# EAGLE schematic Печатная плата управляющая (EAGLE 9.0.0)
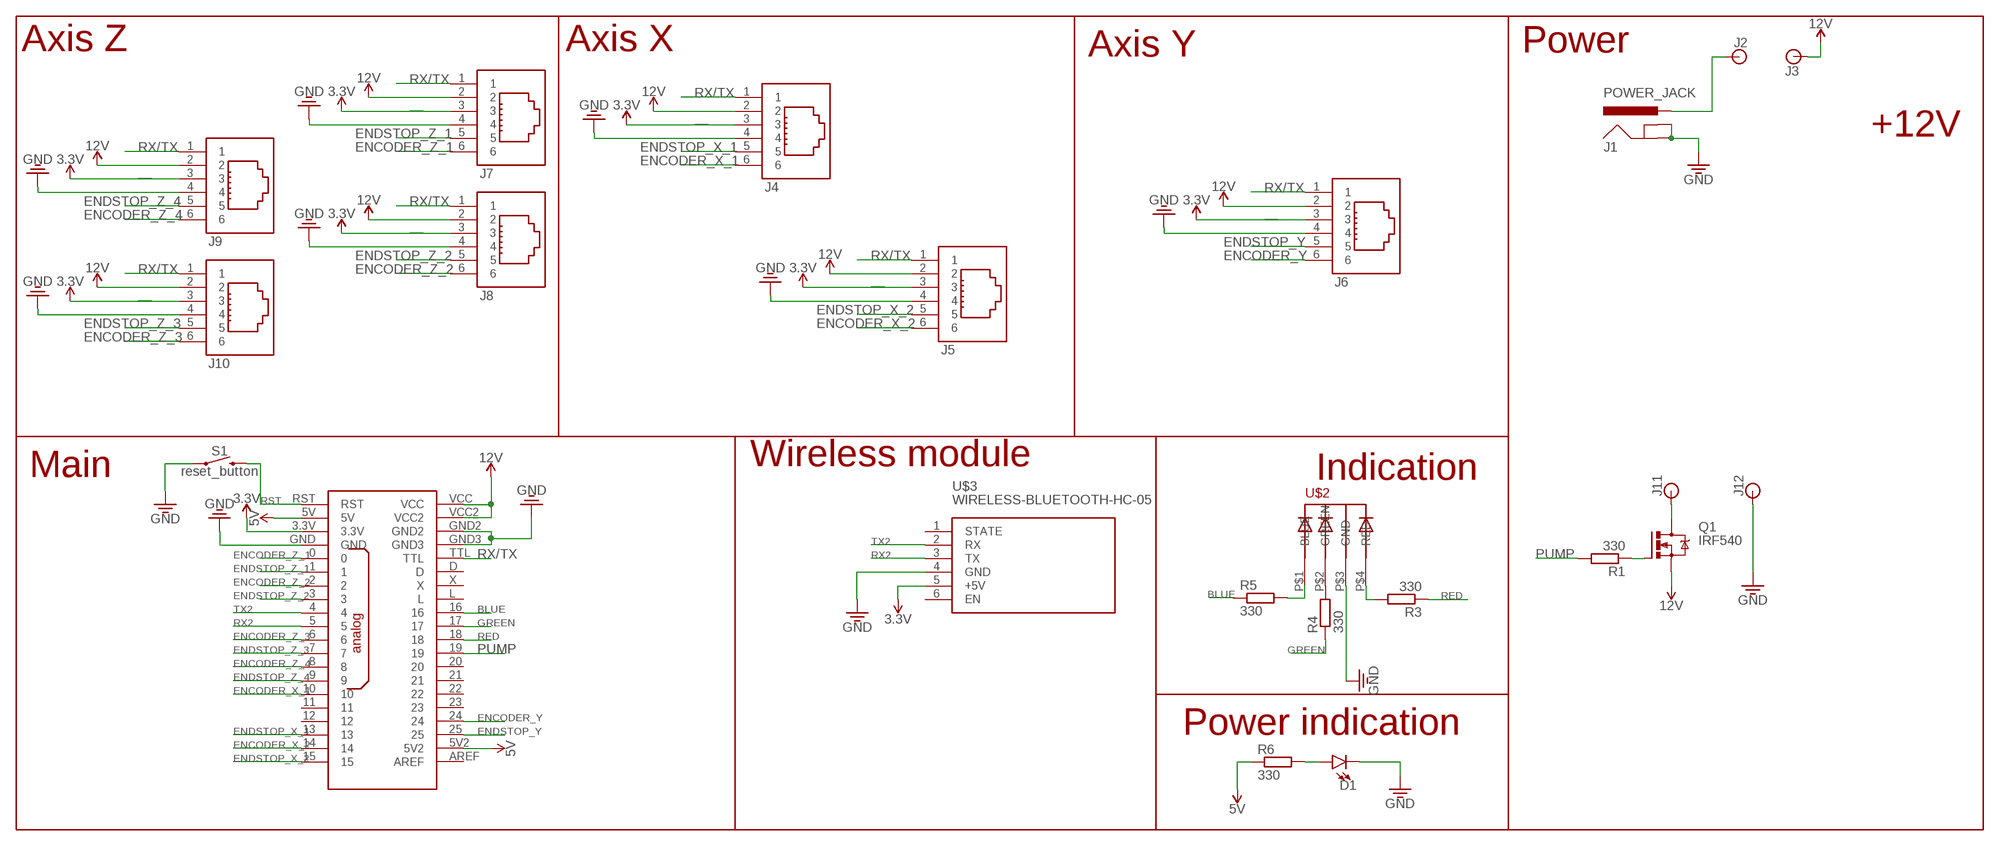
[diagram p0: schematic, sheet 1]

## Parts
D1  LED5MM  [LED_5MM]
J1  POWER_JACK  [POWER_JACK_PTH]
J2  BANANA_CONN  [BANANA_CONN]
J3  BANANA_CONN  [BANANA_CONN]
J4  615006138421  [615006138421]
J5  615006138421  [615006138421]
J6  615006138421  [615006138421]
J7  615006138421  [615006138421]
J8  615006138421  [615006138421]
J9  615006138421  [615006138421]
J10  615006138421  [615006138421]
J11  BANANA_CONN  [BANANA_CONN]
J12  BANANA_CONN  [BANANA_CONN]
Q1  IRF540  [TO220BV]
R1  330  R-EU_0204/7  [0204/7]
R3  330  R-EU_0204/7  [0204/7]
R4  330  R-EU_0204/7  [0204/7]
R5  330  R-EU_0204/7  [0204/7]
R6  330  R-EU_0204/7  [0204/7]
S1  reset_button  MOMENTARY-SWITCH-SPST-PTH-6.0MM  [TACTILE_SWITCH_PTH_6.0MM]
U$1  OPENCM9.04  [OPENCM9.04]
U$2  5MMRGBLED  [LED5MMRGB]
U$3  WIRELESS-BLUETOOTH-HC-05  [WIRELESS-BLUETOOTH-HC-05]

## Nets
3.3V: J4.3 J5.3 J6.3 J7.3 J8.3 J9.3 J10.3 U$1.3.3V U$3.5(+5V)
5V: R6.1 U$1.5V U$1.5V2
12V: J3.P$1 J4.2 J5.2 J6.2 J7.2 J8.2 J9.2 J10.2 Q1.S U$1.VCC U$1.VCC2
BLUE: R5.1 U$1.16
ENCODER_X_1: J4.6 U$1.10
ENCODER_X_2: J5.6 U$1.14
ENCODER_Y: J6.6 U$1.24
ENCODER_Z_1: J7.6 U$1.0
ENCODER_Z_2: J8.6 U$1.2
ENCODER_Z_3: J10.6 U$1.6
ENCODER_Z_4: J9.6 U$1.8
ENDSTOP_X_1: J4.5 U$1.13
ENDSTOP_X_2: J5.5 U$1.15
ENDSTOP_Y: J6.5 U$1.25
ENDSTOP_Z_1: J7.5 U$1.1
ENDSTOP_Z_2: J8.5 U$1.3
ENDSTOP_Z_3: J10.5 U$1.7
ENDSTOP_Z_4: J9.5 U$1.9
GND: D1.K(C) J1.GND J1.GNDBREAK J4.4 J5.4 J6.4 J7.4 J8.4 J9.4 J10.4 J12.P$1 S1.1 U$1.GND U$1.GND2 U$1.GND3 U$2.P$3(GND) U$3.4(GND)
GREEN: R4.1 U$1.17
N$1: J11.P$1 Q1.D
N$2: R4.2 U$2.P$2(GREEN)
N$3: Q1.G R1.1
N$4: R5.2 U$2.P$1(BLUE)
N$5: R3.2 U$2.P$4(RED)
N$6: D1.A R6.2
N$7: J1.PWR J2.P$1
PUMP: R1.2 U$1.19
RED: R3.1 U$1.18
RST: S1.3 U$1.RST
RX2: U$1.5 U$3.3(TX)
RX/TX: J4.1 J5.1 J6.1 J7.1 J8.1 J9.1 J10.1 U$1.TTL
TX2: U$1.4 U$3.2(RX)
Unconnected: U$1.11 U$1.12 U$1.20 U$1.21 U$1.22 U$1.23 U$1.AREF U$1.D U$1.L U$1.X U$3.1(STATE) U$3.6(EN)

## Notes on the sheet
- Axis Z | Axis X | Axis Y | Power
- +12V
- Main | Wireless module
- Indication
- Power indication

## Library data of the parts
D1 = SparkFun-LED:LED: LED (Generic) Standard schematic elements and footprints for 5mm, 3mm, 1206, and 0603 sized LEDs. Generic LEDs with no color specified.
J1 = SparkFun-Connectors:POWER_JACK: Power Jack Connector This is the standard 5.5mm barrel jack for power. The PTH is the most common, proven, reliable, footprint. The Slot footprint only works if the mill layer is transmitted to the PCB fab house so be warned. Here are the connectors we sell at SparkFun: DC Barrel Power Jack/Connector <https://www.sparkfun.com/products/119> (PRT-00119) DC Barrel Power Jack/Connector (SMD) <https://www.sparkfun.com/products/12748> (PRT-12748) DC Barrel Jack Adapter - Breadboard Compatible <https://www.sparkfun.com/products/10811> (PRT-10811) It is used on this SparkFun product (and many, many others): SparkFun RedBoard - Programmed with Arduino <https://www.sparkfun.com/products/12757> (DEV-12757) Also, if you need a mating power supply or connector, please check these out: Wall Adapter Power Supply - 9VDC 650mA <https://www.sparkfun.com/products/298> (TOL-00298) DC Barrel Jack Adapter - Male <https://www.sparkfun.com/products/10287> (PRT-10287); PROD_ID: CONN-08197
J2 J3 J11 J12 = SparkFun-Connectors:BANANA_CONN: Through-hole Banana Jack Basic PTH connection for banana jack plugs SparkFun Products: Multimeter Kit <https://www.sparkfun.com/products/retired/10956> Banana to Alligator Cable <https://www.sparkfun.com/products/retired/509> Banana to Alligator Coax Cable <https://www.sparkfun.com/products/retired/508> Banana to Banana Cable <https://www.sparkfun.com/products/retired/507> Banana to IC Hook Cables <https://www.sparkfun.com/products/retired/506>
J4-J10 = Wurth_Elektronik_Electromechanic_Input-Output_Connectors_rev16a:615006138421: WR-MJ Horizontal Plastic 6P6C Modular Jack Tab Up, 6 Pins=>Code : Con_I-O_MJ-H_Plastic_Up_615006138421 <http://katalog.we-online.de/media/images/eican/Con_I-O_MJ-H_Plastic_Up_6150xx138421_pf2.jpg> Details see: http://katalog.we-online.de/en/em/615_0xx_138_121 Created 2014-07-10, Karrer Zheng 2014 (C) Würth Elektronik
Q1 = transistor-power:IRF540: HEXFET Power MOSFET
R1 R3-R6 = resistor:R-EU_: RESISTOR, European symbol
S1 = SparkFun-Switches:MOMENTARY-SWITCH-SPST: Momentary Switch (Pushbutton) - SPST Normally-open (NO) SPST momentary switches (buttons, pushbuttons). Variants PTH-12MM - 12mm square, through-hole Momentary Pushbutton Switch - 12mm Square <https://www.sparkfun.com/products/9190> (COM-09190) PTH-6.0MM, PTH-6.0MM-KIT - 6.0mm square, through-hole Mini Pushbutton Switch <https://www.sparkfun.com/products/97> (COM-00097) KIT package intended for soldering kit's - only one side of pads' copper is exposed. PTH-RIGHT-ANGLE-KIT - Right-angle, through-hole Right Angle Tactile Button <https://www.sparkfun.com/products/10791> - Used on SparkFun BigTime Watch Kit <https://www.sparkfun.com/products/11734> SMD-12MM - 12mm square, surface-mount Tactile Button - SMD (12mm) <https://www.sparkfun.com/products/12993> (COM-12993) Used on SparkFun PicoBoard <https://www.sparkfun.com/products/11888> SMD-4.5MM - 4.5mm Square Trackball Switch Used on SparkFun Blackberry Trackballer Breakout <https://www.sparkfun.com/products/13169> SMD-4.6MMX2.8MM - 4.60mm x 2.80mm, surface mount Used on SparkFun SAMD21 Mini Breakout <https://www.sparkfun.com/products/13664> SMD-5.2MM, SMD-5.2-REDUNDANT - 5.2mm square, surface-mount Mini Pushbutton Switch - SMD <https://www.sparkfun.com/products/8720> (COM-08720) Used on Arduino Pro Mini <https://www.sparkfun.com/products/11114> REDUNDANT package connects both switch circuits together SMD-6.0X3.5MM - 6.0 x 3.5mm, surface mount Momentary Reset Switch SMD <https://www.sparkfun.com/products/8229> (COM-08229) SMD-6.2MM-TALL - 6.2mm square, surface mount Tactile Button - SMD (6mm) <https://www.sparkfun.com/products/12992> Used on SparkFun Digital Sandbox <https://www.sparkfun.com/products/12651> SMD-RIGHT-ANGLE - Right-angle, surface mount Used on SparkFun Block for Intel® Edison - Arduino <https://www.sparkfun.com/products/13036>; PROD_ID: SWCH-08441; SF_SKU: COM-00097
U$1 = OpenCM9.04:OPENCM9.04
U$2 = led_rgb:5MMRGBLED
U$3 = diy-modules:WIRELESS-BLUETOOTH-HC-05: Bluetooth Transceiver Module based on HC-05 board Tutorial is available here: https://arduino-info.wikispaces.com/BlueTooth-HC05-HC06-Modules-How-To Click here to find device on ebay.com <http://www.ebay.com/sch/hc-05+module+rs232>